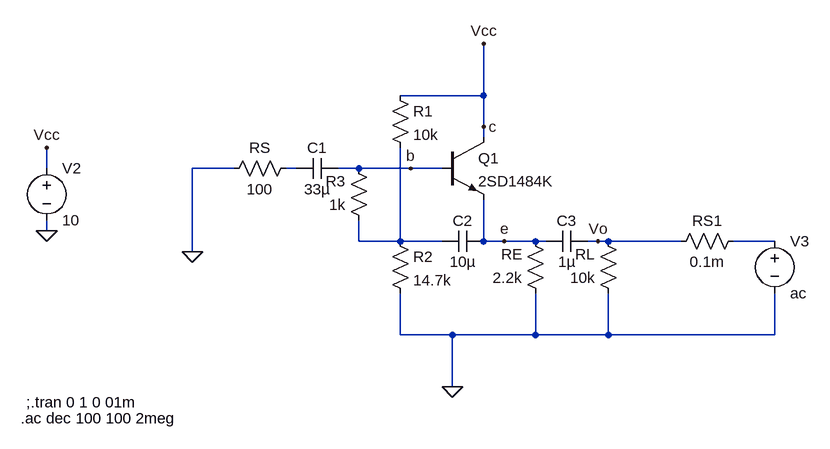
[diagram p0: schematic Bootstrap.asc]
Bootstrap.asc, the LTspice schematic file:
Version 4
SHEET 1 880 680
WIRE 368 0 368 -80
WIRE 368 0 240 0
WIRE 368 48 368 0
WIRE 368 64 368 48
WIRE -304 112 -304 80
WIRE -16 112 -80 112
WIRE 80 112 64 112
WIRE 176 112 144 112
WIRE 256 112 176 112
WIRE 304 112 256 112
WIRE -304 208 -304 192
WIRE 176 224 176 192
WIRE 240 224 240 80
WIRE 240 224 176 224
WIRE 304 224 240 224
WIRE 368 224 368 160
WIRE 400 224 368 224
WIRE 448 224 400 224
WIRE 464 224 448 224
WIRE 544 224 528 224
WIRE 560 224 544 224
WIRE 672 224 560 224
WIRE 816 224 752 224
WIRE -80 240 -80 112
WIRE 240 368 240 304
WIRE 320 368 240 368
WIRE 448 368 448 304
WIRE 448 368 320 368
WIRE 560 368 560 304
WIRE 560 368 448 368
WIRE 816 368 816 304
WIRE 816 368 560 368
WIRE 320 448 320 368
FLAG 368 -80 Vcc
FLAG 320 448 0
FLAG -80 240 0
FLAG -304 208 0
FLAG -304 80 Vcc
FLAG 544 224 Vo
FLAG 368 48 c
FLAG 256 112 b
FLAG 400 224 e
SYMBOL res 80 96 R90
WINDOW 0 0 56 VBottom 2
WINDOW 3 32 56 VTop 2
SYMATTR InstName RS
SYMATTR Value 100
SYMBOL cap 144 96 R90
WINDOW 0 0 32 VBottom 2
WINDOW 3 32 32 VTop 2
SYMATTR InstName C1
SYMATTR Value 33µ
SYMBOL res 224 208 R0
SYMATTR InstName R2
SYMATTR Value 14.7k
SYMBOL res 224 -16 R0
SYMATTR InstName R1
SYMATTR Value 10k
SYMBOL res 192 208 R180
WINDOW 0 36 76 Left 2
WINDOW 3 36 40 Left 2
SYMATTR InstName R3
SYMATTR Value 1k
SYMBOL res 464 320 R180
WINDOW 0 36 76 Left 2
WINDOW 3 36 40 Left 2
SYMATTR InstName RE
SYMATTR Value 2.2k
SYMBOL res 576 320 R180
WINDOW 0 36 76 Left 2
WINDOW 3 36 40 Left 2
SYMATTR InstName RL
SYMATTR Value 10k
SYMBOL npn 304 64 R0
SYMATTR InstName Q1
SYMATTR Value 2SD1484K
SYMBOL cap 368 208 R90
WINDOW 0 0 32 VBottom 2
WINDOW 3 32 32 VTop 2
SYMATTR InstName C2
SYMATTR Value 10µ
SYMBOL cap 528 208 R90
WINDOW 0 0 32 VBottom 2
WINDOW 3 32 32 VTop 2
SYMATTR InstName C3
SYMATTR Value 1µ
SYMBOL voltage -304 96 R0
WINDOW 123 0 0 Left 0
WINDOW 39 0 0 Left 0
SYMATTR InstName V2
SYMATTR Value 10
SYMBOL voltage 816 208 R0
WINDOW 123 0 0 Left 0
WINDOW 39 0 0 Left 0
SYMATTR InstName V3
SYMATTR Value ac
SYMBOL res 768 208 R90
WINDOW 0 0 56 VBottom 2
WINDOW 3 32 56 VTop 2
SYMATTR InstName RS1
SYMATTR Value 0.1m
TEXT -336 472 Left 2 !;.tran 0 1 0 01m
TEXT -344 496 Left 2 !.ac dec 100 100 2meg

The netlist it stands for:
* Bootstrap.asc
RS N001 0 100
C1 b N001 33µ
R2 N002 0 14.7k
R1 c N002 10k
R3 N002 b 1k
RE 0 e 2.2k
RL 0 Vo 10k
Q1 c b e 0 2SD1484K
C2 e N002 10µ
C3 Vo e 1µ
V2 c 0 10
V3 N003 0 ac
RS1 N003 Vo 0.1m
.model NPN NPN
.model PNP PNP
.lib standard.bjt
;.tran 0 1 0 01m
.ac dec 100 100 2meg
.backanno
.end